# Altium schematic sheet lv_controller_power.SchDoc
size A4; SheetNumber: 2; SheetTotal: 3
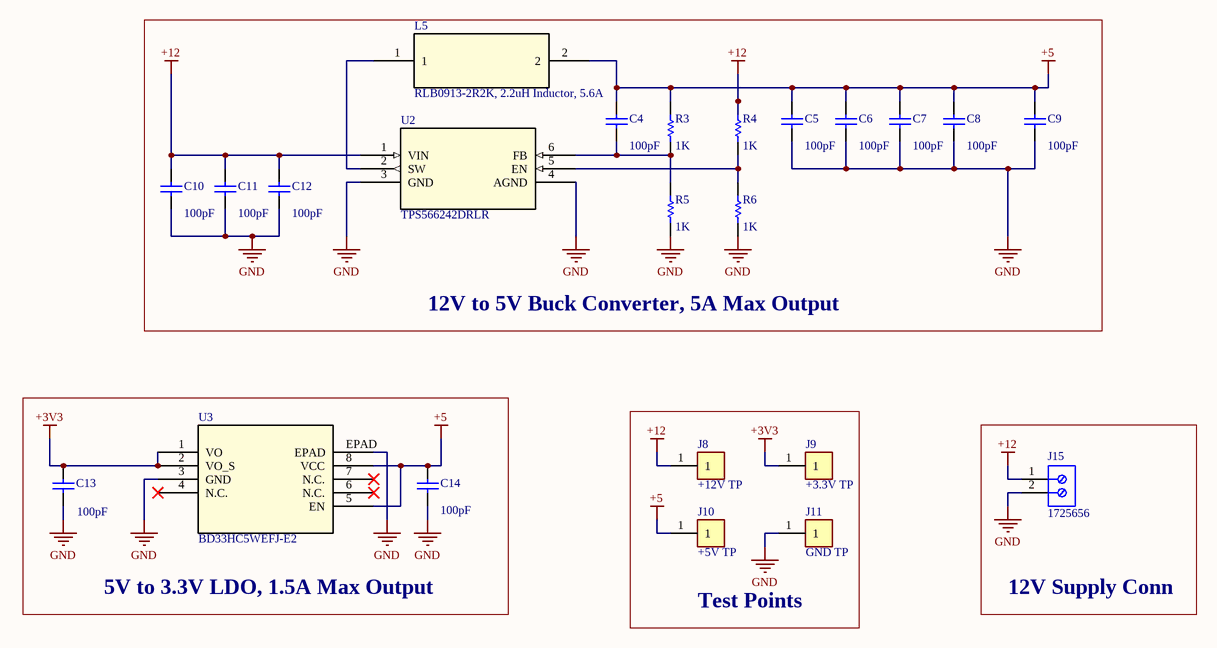
[diagram p0: lv_controller_power.SchDoc]

## Parts
C4  value 100pF  [C0805]  (hidden comment: Cap)
C5  value 100pF  [C0805]  (hidden comment: Cap)
C6  value 100pF  [C0805]  (hidden comment: Cap)
C7  value 100pF  [C0805]  (hidden comment: Cap)
C8  value 100pF  [C0805]  (hidden comment: Cap)
C9  value 100pF  [C0805]  (hidden comment: Cap)
C10  value 100pF  [C0805]  (hidden comment: Cap)
C11  value 100pF  [C0805]  (hidden comment: Cap)
C12  value 100pF  [C0805]  (hidden comment: Cap)
C13  value 100pF  [C0805]  (hidden comment: Cap)
C14  value 100pF  [C0805]  (hidden comment: Cap)
J8  +12V TP  [KEYSTONE_5000]
J9  +3.3V TP  [KEYSTONE_5000]
J10  +5V TP  [KEYSTONE_5000]
J11  GND TP  [KEYSTONE_5000]
J15  1725656  [PHOE-1725656-2]
L5  RLB0913-2R2K, 2.2uH Inductor, 5.6A  [RLB0913-4R7K_BRN]
R3  value 1K  [6-0805_M]  (hidden comment: Res1)
R4  value 1K  [6-0805_M]  (hidden comment: Res1)
R5  value 1K  [6-0805_M]  (hidden comment: Res1)
R6  value 1K  [6-0805_M]  (hidden comment: Res1)
U2  TPS566242DRLR  [SOT5x3_DRL_TEX]
U3  BD33HC5WEFJ-E2  [HTSOP-J8_ROM]

## Blocks framed on the sheet
12V to 5V Buck Converter, 5A Max Output: C4-C12 L5 R3-R6 U2
5V to 3.3V LDO, 1.5A Max Output: C13 C14 U3
Test Points: J8-J11
12V Supply Conn: J15

## Nets
+3V3: C13.2 J9.1 U3.1(VO) U3.2(VO_S)
+5: C4.2 C5.2 C6.2 C7.2 C8.2 C9.2 C14.2 J10.1 L5.2 R3.1 U3.5(EN) U3.8(VCC)
+12: C10.2 C11.2 C12.2 J8.1 J15.1 R4.1 U2.1(VIN)
GND: C5.1 C6.1 C7.1 C8.1 C9.1 C10.1 C11.1 C12.1 C13.1 C14.1 J11.1 J15.2 R5.2 R6.2 U2.3(GND) U2.4(AGND) U3.3(GND) U3.EPAD
NetC4_1: C4.1 R3.2 R5.1 U2.6(FB)
NetL5_1: L5.1 U2.2(SW)
NetR4_2: R4.2 R6.1 U2.5(EN)

Not connected (* = marked no-connect by the designer): U3 4(N.C.)* 6(N.C.)* 7(N.C.)*

## Library data of the parts
C4-C14 = Cap: Capacitor; Published: 8-Jun-2000; LatestRevisionDate: 17-Jul-2002; LatestRevisionNote: Re-released for DXP Platform.; PackageReference: RAD-0.3; Publisher: Altium Limited; PackageDescription: Radial Cap, Thru-Hole; 2 Leads; 0.3 in Pin Spacing
J8-J11 = 5000: High Pin Count, Backplane Connectors, Receptacle, Right Angle, Through Hole, 4 Row, 120 Positions, 0 Guide Pin, 2.54mm (0.100in) Pitch; MF: Keystone; MP: 5000; Package: Custom Package Ohmite; Availability: Good; Price: None; Purchase-URL: https://pricing.snapeda.com/search/part/5000/?ref=eda; SnapEDA_Link: https://www.snapeda.com/parts/5000/Keystone/view-part/883846/?ref=snap; Value: *; Check_prices: https://www.snapeda.com/parts/5000/Keystone/view-part/883846/?ref=eda
J15 = CMP-2000-05299-1: Male Header, Pitch 2.54 mm, 1 x 2 Position, Height 9 mm, Tail Length 3.5 mm; Manufacturer: Phoenix Contact; Number of contacts: 2; Content: 250pc(s); Pitch: 2.54mm; Industrial packaging: Yes; Colour: Green; Manufacturer part No.: 1725656; Type: MPT0,5/2-2,54; Datasheet URL: http://datasheet.octopart.com/1725656-Phoenix-Contact-datasheet-5302866.pdf; Manufacturer URL: http://www.phoenixcontact.com/; Datasheet Version: Apr-08
L5 = RLB0913-4R7K: No Description Available; Mfr_Name: Bourns Electronics; Type: DEV; Copyright: Copyright (C) 2022 Ultra Librarian. All rights reserved.; Manufacturer_Part_Number: RLB0913-4R7K; RefDes: RefDes
R3-R6 = Res1: Resistor; Published: 8-Jun-2000; LatestRevisionDate: 17-Jul-2002; LatestRevisionNote: Re-released for DXP Platform.; PackageReference: AXIAL-0.3; Publisher: Altium Limited; PackageDescription: Axial Device, Thru-Hole; 2 Leads; 0.3 in Pin Spacing
U2 = TPS566242DRLR: No Description Available; Mfr_Name: Texas Instruments; Copyright: Copyright (C) 2022 Ultra Librarian. All rights reserved.; Manufacturer_Part_Number: TPS566242DRLR; RefDes: RefDes; Type: DEV
U3 = BD33HC5WEFJ-E2: No Description Available; Mfr_Name: ROHM Semiconductor; Copyright: Copyright (C) 2022 Ultra Librarian. All rights reserved.; Manufacturer_Part_Number: BD33HC5WEFJ-E2; RefDes: RefDes; Type: DEV